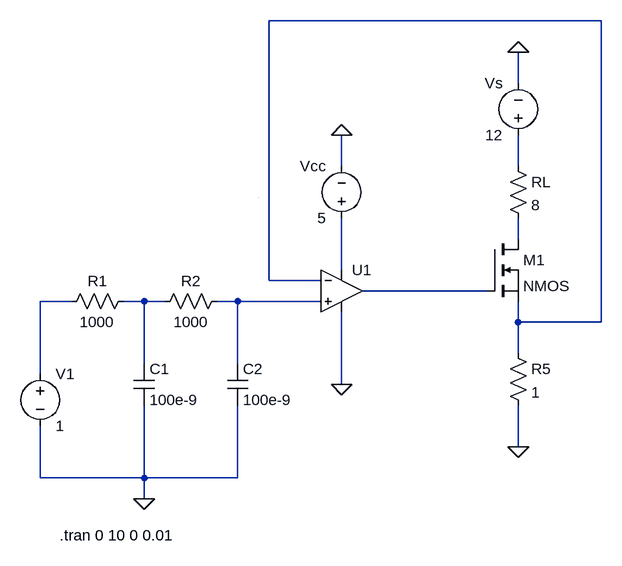
[diagram p0: schematic constant_current_drive.asc]
constant_current_drive.asc, the LTspice schematic file:
Version 4
SHEET 1 880 680
WIRE 528 -272 16 -272
WIRE 400 -176 400 -224
WIRE 128 -48 128 -96
WIRE 400 -48 400 -96
WIRE 400 64 400 32
WIRE 128 112 128 32
WIRE 16 128 16 -272
WIRE 96 128 16 128
WIRE 352 144 160 144
WIRE -288 160 -336 160
WIRE -176 160 -208 160
WIRE -144 160 -176 160
WIRE -32 160 -64 160
WIRE 96 160 -32 160
WIRE 400 192 400 160
WIRE 528 192 528 -272
WIRE 528 192 400 192
WIRE 400 240 400 192
WIRE -176 256 -176 160
WIRE -32 256 -32 160
WIRE -336 272 -336 160
WIRE 128 288 128 176
WIRE 400 384 400 320
WIRE -336 432 -336 352
WIRE -176 432 -176 320
WIRE -176 432 -336 432
WIRE -32 432 -32 320
WIRE -32 432 -176 432
WIRE -176 464 -176 432
WIRE 0 0 0 0
FLAG 400 384 0
FLAG -176 464 0
FLAG 128 288 0
FLAG 400 -224 0
FLAG 128 -96 0
SYMBOL res 384 -64 R0
SYMATTR InstName RL
SYMATTR Value 8
SYMBOL res 384 224 R0
SYMATTR InstName R5
SYMATTR Value 1
SYMBOL res -192 144 R90
WINDOW 0 0 56 VBottom 2
WINDOW 3 32 56 VTop 2
SYMATTR InstName R1
SYMATTR Value 1000
SYMBOL nmos 352 64 R0
SYMATTR InstName M1
SYMBOL voltage 400 -80 R180
WINDOW 0 24 96 Left 2
WINDOW 3 24 16 Left 2
WINDOW 123 0 0 Left 0
WINDOW 39 0 0 Left 0
SYMATTR InstName Vs
SYMATTR Value 12
SYMBOL cap -192 256 R0
SYMATTR InstName C1
SYMATTR Value 100e-9
SYMBOL res -48 144 R90
WINDOW 0 0 56 VBottom 2
WINDOW 3 32 56 VTop 2
SYMATTR InstName R2
SYMATTR Value 1000
SYMBOL cap -48 256 R0
SYMATTR InstName C2
SYMATTR Value 100e-9
SYMBOL voltage 128 48 R180
WINDOW 0 24 96 Left 2
WINDOW 3 24 16 Left 2
WINDOW 123 0 0 Left 0
WINDOW 39 0 0 Left 0
SYMATTR InstName Vcc
SYMATTR Value 5
SYMBOL voltage -336 256 R0
WINDOW 123 0 0 Left 0
WINDOW 39 0 0 Left 0
SYMATTR InstName V1
SYMATTR Value 1
SYMBOL OpAmps\\UniversalOpAmp 128 144 R0
SYMATTR InstName U1
TEXT -306 520 Left 2 !.tran 0 10 0 0.01

The netlist it stands for:
* constant_current_drive.asc
RL N002 N003 8
R5 N001 0 1
R1 N007 N006 1000
M1 N003 N005 N001 N001 NMOS
Vs N002 0 12
C1 N007 0 100e-9
R2 N008 N007 1000
C2 N008 0 100e-9
Vcc N004 0 5
V1 N006 0 1
XU1 N008 N001 N004 0 N005 level1 Avol=1Meg GBW=10Meg Vos=0 En=0 Enk=0 In=0 Ink=0 Rin=500Meg  ; pins In+ In- V+ V- OUT
.model NMOS NMOS
.model PMOS PMOS
.lib standard.mos
.tran 0 10 0 0.01
.lib UniversalOpAmp1.lib
.backanno
.end